# Altium schematic sheet POWER.SchDoc
size A3; SheetNumber: 8; SheetTotal: 8
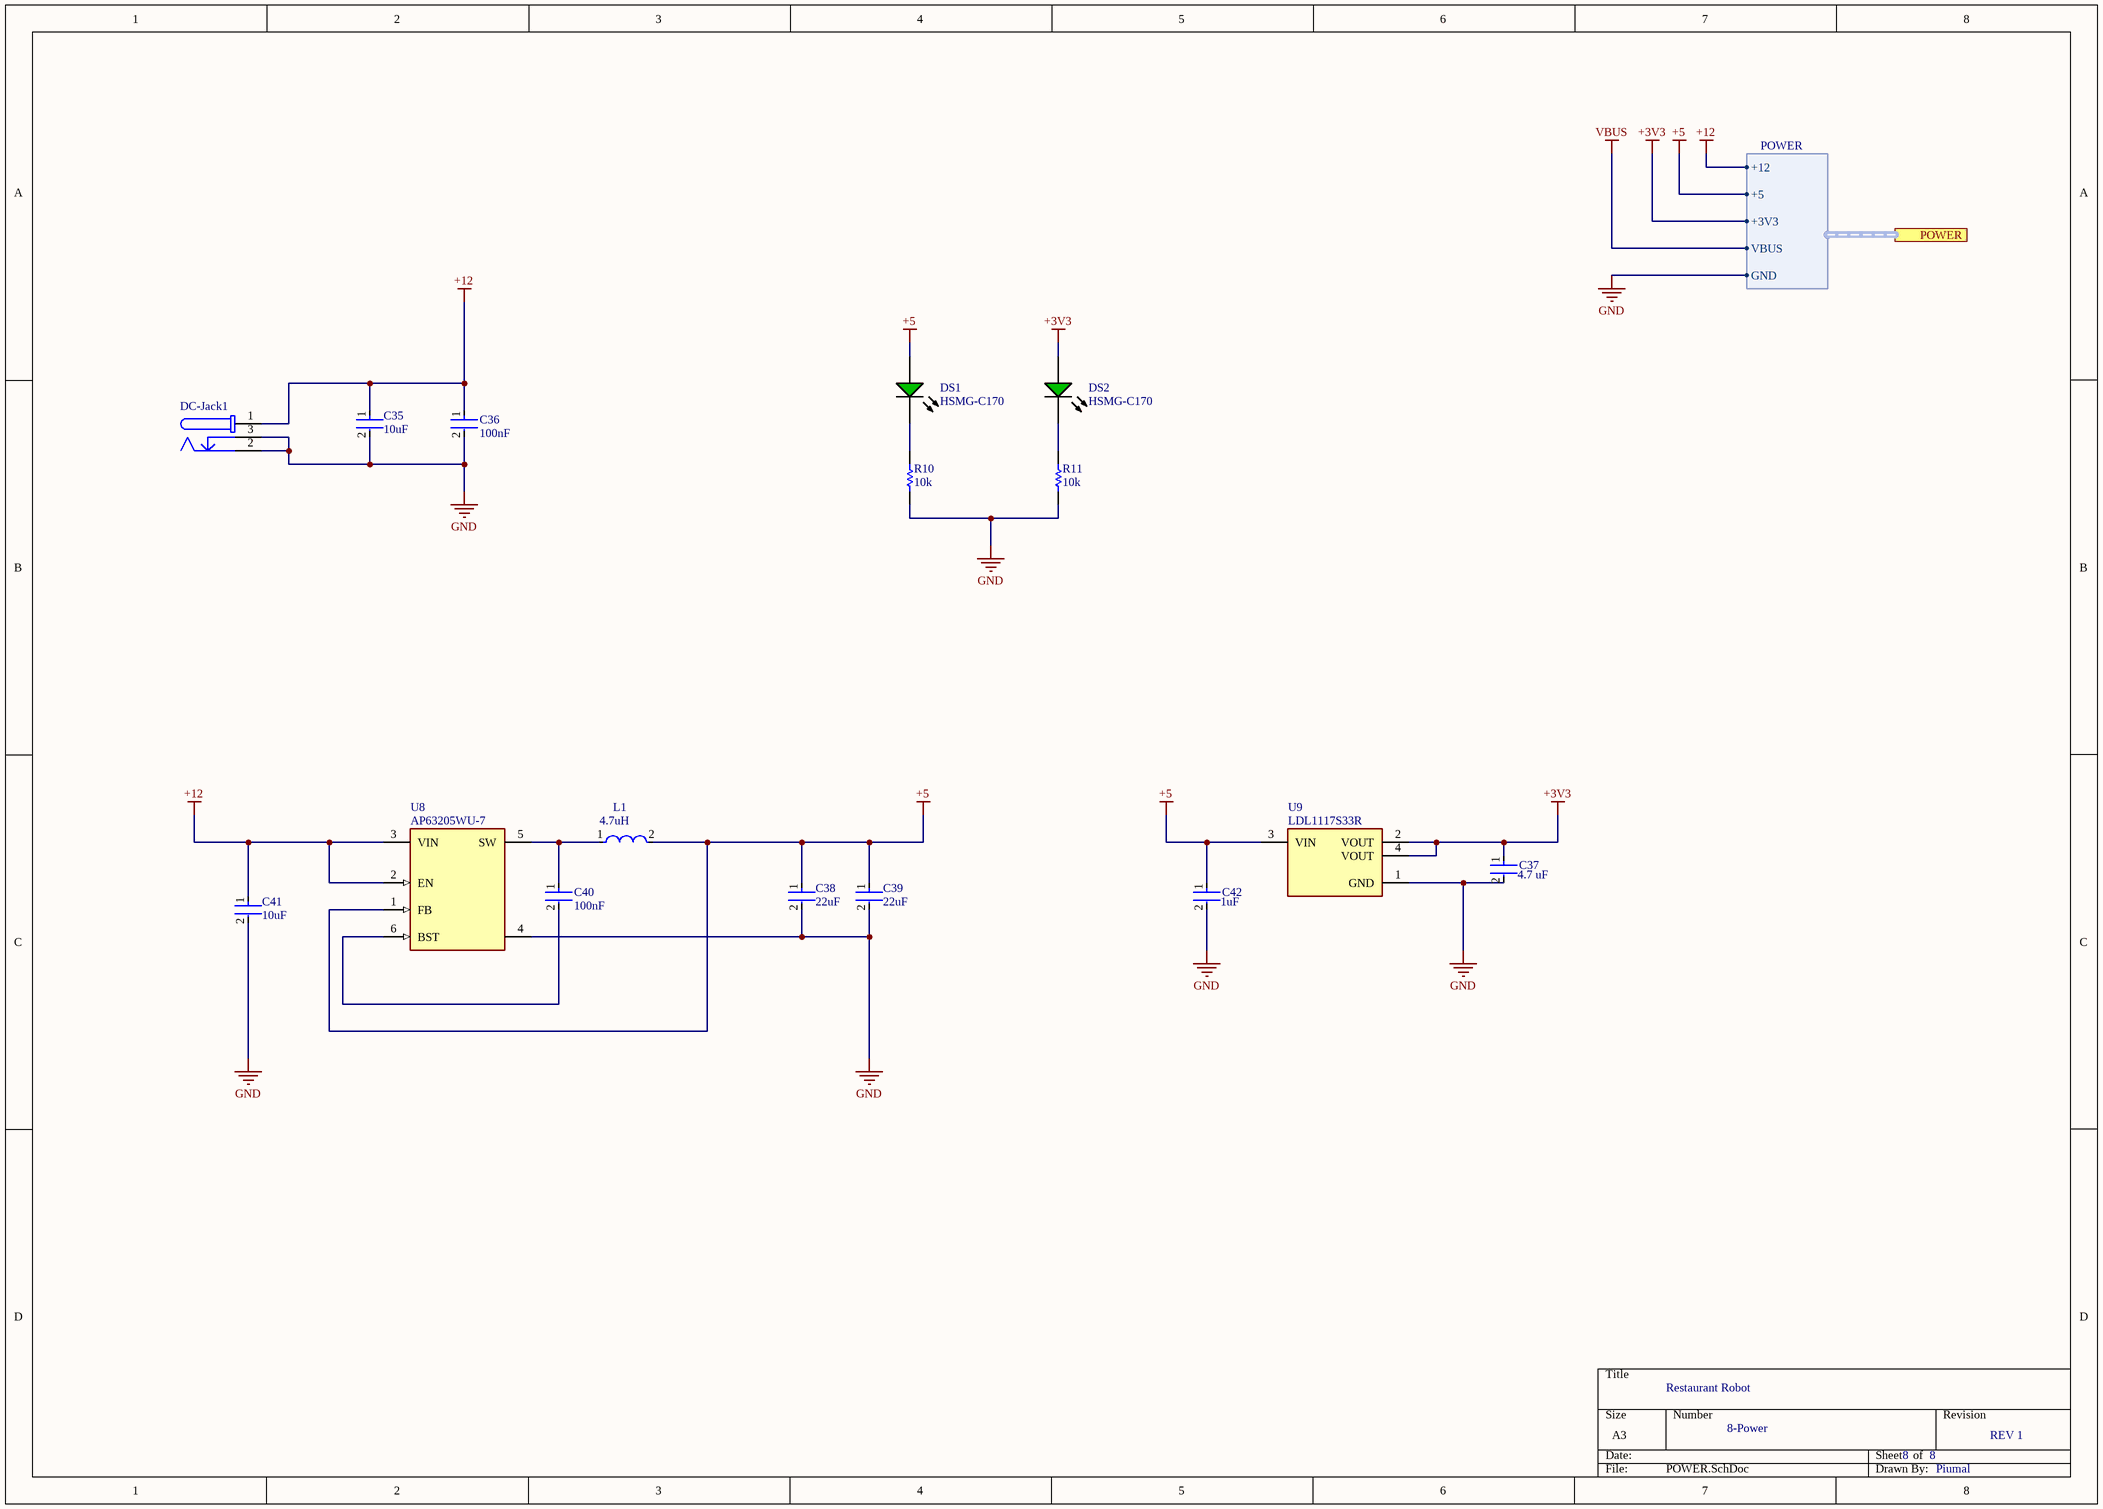
[diagram p0: POWER.SchDoc]

## Parts
C35  Capacitance: 10uF  [FP-1206-L_3_2_0_2-W_1_6_0-IPC_A]  (hidden comment: 1206ZD106KAT2A)
C36  100nF  [FP-0805-L_2_01_0_2-W_1_25-IPC_B]
C37  Capacitance: 4.7 uF  [FP-CC1206-1_25-MFG]  (hidden comment: CC1206KKX7R9BB475)
C38  Capacitance: 22uF  [FP-C3216-160-0_2-IPC_B]  (hidden comment: C3216X5R1E226M160AB)
C39  Capacitance: 22uF  [FP-C3216-160-0_2-IPC_B]  (hidden comment: C3216X5R1E226M160AB)
C40  100nF  [FP-0805-L_2_01_0_2-W_1_25-IPC_B]
C41  Capacitance: 10uF  [FP-1206-L_3_2_0_2-W_1_6_0-IPC_A]  (hidden comment: 1206ZD106KAT2A)
C42  Capacitance: 1uF  [FP-1206-L_3_2_0_2-W_1_6_0-IPC_A]  (hidden comment: 12065C105KAT2A)
DC-Jack1  694106301002  [694106301002]  (value not drawn)
DS1  HSMG-C170  [AVAG-HSMX-C170_V]
DS2  HSMG-C170  [AVAG-HSMX-C170_V]
L1  Inductance: 4.7uH  [FP-IHLP-2525BD-FP_2_413x3-MFG]  (hidden comment: IHLP2525BDER4R7M01)
R10  Resistance: 10k  [RESC2013X60X35ML10T20]  (hidden comment: RC0805JR-0710KL)
R11  Resistance: 10k  [RESC2013X60X35ML10T20]  (hidden comment: RC0805JR-0710KL)
U8  AP63205WU-7  [FP-TSOT26-MFG]
U9  LDL1117S33R  [FP-SOT223-0046067-IPC_C]

## Ports
POWER (harness POWER)

## Harnesses
POWER: +3V3, GND, +5, VBUS, +12

## Nets
+3V3: C37.1 DS2.1(A) U9.2(VOUT) U9.4(VOUT) ; port POWER.+3V3
+5: C38.1 C39.1 C42.1 DS1.1(A) L1.2 U8.1(FB) U9.3(VIN) ; port POWER.+5
+12: C35.1 C36.1 C41.1 DC-Jack1.1 U8.2(EN) U8.3(VIN) ; port POWER.+12
GND: C35.2 C36.2 C37.2 C38.2 C39.2 C41.2 C42.2 DC-Jack1.2 DC-Jack1.3 R10.2 R11.2 U8.4(GND) U9.1(GND) ; port POWER.GND
VBUS: port POWER.VBUS
NetC40_1: C40.1 L1.1 U8.5(SW)
NetC40_2: C40.2 U8.6(BST)
NetDS1_2: DS1.2(K) R10.1
NetDS2_2: DS2.2(K) R11.1

## Notes on the sheet
- Restaurant Robot
- 8-Power
- 8
- REV 1
- Piumal

## Library data of the parts
C35 C41 = CMP-04427-021870-1: General Purpose Ceramic Capacitor, 1206, 10uF, 10%, X5R, 15%, 10V; Tolerance: 10%; Thickness: 0.07inch; Voltage: 10V; Termination: SMD/SMT; REACH SVHC: No SVHC; Radiation Hardening: No; Lead Free: Lead Free; Min Operating Temperature: -55°C; Contact Plating: Tin; Length: 3.2mm; Dielectric: X5R; Packaging: Tape and Reel; Construction: Flat; RoHS Compliant: Yes; Series: -; Voltage Rating: 10V; Height: 0.07mm; Width: 0.063inch; Voltage Rating (DC): 10V; Mount: Surface Mount; Depth: 1.6mm; Number of Pins: 2; Case Code (Imperial): 1206; Size: 1.78mm; Case/Package: 1206; Max Operating Temperature: 85°C; Package Quantity: 1; Case Code (Metric): 3216
C36 C40 = CMP-2007-04172-2: Automotive Ceramic Capacitor, 0805, 100nF, 10%, X7R, 15%, 100V; Voltage Rating (DC): 100V; Case Code (Metric): 2012; Mount: Surface Mount; Length: 2.01mm; Depth: 1.25mm; Lead Free: Lead Free; Ratings: AEC-Q200; Max Operating Temperature: 125°C; Tolerance: 10%; Case/Package: 0805; Width: 0.049inch; Package Quantity: 1; Thickness: 0.055inch; Construction: Flat; Min Operating Temperature: -55°C; REACH SVHC: No SVHC; Number of Pins: 2; Radiation Hardening: No; Capacitance: 100nF; Voltage Rating: 100V; Height: 1.4mm; Series: -; Voltage: 100V; Dielectric: X7R; Termination: SMD/SMT; Case Code (Imperial): 0805; RoHS Compliant: Yes; Packaging: Tape and Reel; Dielectric Material: Ceramic
C37 = CMP-03422-000173-1: CAP CER 4.7UF 50V X7R 1206; Manufacturer: Yageo; Automotive Grade: NA; Tolerance: 0.1; Temperature Coefficient: 15%; Material: Ceramic; Device Class L1: Passive Components; Category: Cap; Height: 1.45mm; Temperature Range Low: -55°C; Temperature Range High: +125°C; Manufacturer Part Number: CC1206KKX7R9BB475; Package: CC1206-1.25; Lead Free: Yes; Temperature: -55°C to +125°C; RoHS: TRUE; Digikey Description: CAP CER 4.7UF 50V X7R 1206; Voltage Rating: 50 V; Device Class L2: Capacitors; Footprint Url: http://www.yageo.com/exep/pages/download/literatures/UPY-C_GEN_24.pdf; ComponentLink2URL: http://www.yageo.com/documents/recent/UPY-NP0X7R_HV_1KV-to-3KV_11.pdf; Temperature Characteristic: X7R; Mouser Description: CC Series 1206 4.7 uF 50 V ±10% Tolerance X7R Multilayer Ceramic Capacitor; ComponentLink2Description: Datasheet; Device Class L3: Ceramic Capacitors; Octopart: https://octopart.com/cc1206kkx7r9bb475-yageo-50417574; Value: 4.7 uF; Automotive: No
C38 C39 = CMP-08246-004697-1: Multilayer Ceramic Capacitors 22uF ±20% 25V X5R SMD 1206; RoHS Compliant: Yes; Thickness: 0.071inch; Mount: Surface Mount; Termination: SMD/SMT; Height: 1.6mm; Resistor Type: Ceramic; REACH SVHC: No SVHC; Packaging: Tape and Reel; Construction: Flat; Depth: 1.6mm; Lead Free: Lead Free; Tolerance: 20%; Width: 0.063inch; Weight: 0.000571oz; Case Code (Imperial): 1206; Case/Package: 1206; Min Operating Temperature: -55°C; Package Quantity: 1; Voltage Rating (DC): 25V; Length: 3.2mm; Voltage Rating: 25V; Case Code (Metric): 3216; Dielectric: X5R; Series: C; Dielectric Material: Ceramic; Max Operating Temperature: 85°C
C42 = CMP-2000-05866-2: General Purpose Ceramic Capacitor, 1206, 1uF, 10%, X7R, 15%, 50V; Dissipation Factor: 2.5%; Voltage: 25V; Dielectric: X7R; Radiation Hardening: No; Number of Pins: 2; Package Quantity: 1; Case Code (Metric): 3216; Thickness: 0.07inch; Voltage Rating (DC): 50V; Width: 0.063inch; Construction: Flat; Min Operating Temperature: -55°C; Length: 3.2mm; Voltage Rating: 50V; Case Code (Imperial): 1206; Height: 1.78mm; REACH SVHC: No SVHC; Mount: Surface Mount; Max Operating Temperature: 125°C; Depth: 1.6mm; Packaging: Tape and Reel; Tolerance: 10%; Lead Free: Lead Free; Termination: SMD/SMT; RoHS Compliant: Yes; Case/Package: 1206; Contact Plating: Tin; Series: -
DC-Jack1 = CMP-1502-00188-2: NexarPartId: 52676100; Voltage Rating (DC): 20V; Gender: Male; Voltage Rating: 24V; Connector Type: Power; Insulation Resistance: 100MΩ; Current Rating: 5A; Shielding: Unshielded; Number of Contacts: 3; Color: Black; Housing Material: Polyamide; Contact Gender: Female; REACH SVHC: Unknown; Termination: Through Hole; Height: 11mm; RoHS: Compliant; Mount: Through Hole; Flammability Rating: UL94 V-0; Packaging: Bulk; Min Operating Temperature: -40°C; Contact Plating: Tin; Max Operating Temperature: 85°C; Operating Supply Voltage: 24V; Contact Material: Gold, Tin
DS1 DS2 = CMP-2000-05062-1: Chip LED, Green, 2.2 V, -40 to 85 degC, 2-Pin SMD, Pb-Free, Tape and Reel; Manufacturer: Avago; No. of Pins: 2; Peak Wavelength: 570nm; SVHC: NoSVHC(16-Jun-2014); Dominant Wavelength: 572nm; Forward Current If: 20mA; Viewing Angle: 170deg; Lens Shape: Rectangular; PIV Max: 5V; External Width: 1.25mm; LED Type: Standard; External Depth: 0.8mm; Opto Mounting Orientation: Top; Luminous Intensity: 15mcd; Luminous Intensity Min: 4mcd; Forward Voltage VF Max: 2.6V; External Length / Height: 2mm; Bulb Size: 1.25mmx1.4mm; Light Area Height: 1mm; Voltage Vf Typ: 2.2V; Operating Temperature Max: 85degC; Datasheet Version: Oct-08; MSL: MSL2A-4weeks; Peak Forward Current: 20mA; Package Description: 2-Pin Surface Mount Device, Body 2 x 1.25 mm, Height 0.8 mm; Datasheet URL: https://datasheet.ciiva.com/29280/180495-da-01-en-chip-led-hsmg-c170-gelb-gruen-29280971.pdf; Storage Temperature Min: -40degC; LED Colour: Green; Wavelength Typ: 570nm; Mounting Type: SMD; Forward Current If Max: 20mA; Dominant Wavelength Typ: 572nm; LED Mounting: SMD; Operating Temperature Range: -30degCto+85degC; Operating Temperature Min: -30degC; Manufacturer URL: http://www.avagotech.com/; Packaging: CutTape; Luminous Intensity Typ: 15mcd; Package Reference: HSMX-C170; Storage Temperature Max: 85degC; Opto Case Style: SMD; Forward Voltage: 2.2V
L1 = CMP-02424-000271-1: Commercial Inductors, High Saturation Series 4.7uH 4.5A 63mΩ 20%; Self Resonant Frequency: 5MHz; DC Resistance (DCR): 63mR; Max DC Current: 10A; Core Material: Metal; Test Frequency: 100kHz; Shielding: Shielded; Radiation Hardening: No; Number of Pins: 2525; Tolerance: 20%; Termination: SMD/SMT; Depth: 6.72mm; Military Standard: Not; Max Operating Temperature: 125°C; Min Operating Temperature: -55°C; RMS Current (Irms): 4.5A; Width: 6.47mm; Saturation Current: 10A; Height: 2.4mm; Case/Package: 2525; Packaging: Tape and Reel; Current Rating: 4.5A; Length: 6.86mm; Inductance Tolerance: 20%; Package Quantity: 2000; Lead Free: Lead Free; Height - Seated (Max): 0.094inch; Mount: Surface Mount
R10 R11 = CMP-2000-05025-1: Chip Resistor, 10 KOhm, +/- 5%, 0.125 W, -55 to 155 degC, 0805 (2012 Metric), RoHS, Tape and Reel; Manufacturer: Yageo; Resistor Element Type: ThickFilm; Voltage Rating: 150V; Product Range: RCSeries; SVHC: ToBeAdvised; Resistor Case Style: 0805[2012Metric]; Temperature Coefficient: ±100ppm/degC; Power Rating: 250mW; Automotive Qualification Standard: -; Datasheet Version: REV. 2, 09/2004; Packaging: CutTape; Resistance Tolerance: ±5%; MSL: MSL1-Unlimited; Manufacturer URL: http://www.yageo.com/; Datasheet URL: http://www.yageo.ru/pdf/RC0805.pdf; Package Description: 2-Pin Surface Mounted Device, Body 2 x 1.25 mm; Package Reference: 805
U8 = CMP-12757-000001-1: IC REG BUCK 5V 2A TSOT26; Manufacturer: Diodes Inc.; Max Junction Temp: +160°C; Max Duty Cycle: 100%; Standoff Height: 0.01mm; Max Supply Voltage: 32V; Number Of Outputs: 1; Min Supply Voltage: 3.8V; Output Type: Fixed; Switching Frequency: 1100kHz; Nominal Supply Current: 22uA; Automotive: No; RoHS: TRUE; Switching Topology: Buck; Temperature: -40°C to +85°C; Footprint Url: https://www.diodes.com/assets/Package-Files/TSOT26.pdf; Lead Free: Yes; Digikey Description: IC REG BUCK 5V 2A TSOT26; Device Class L3: Voltage Regulators - Switching; Ambient Temperature Range High: +85°C; Category: IC; Package: TSOT26; Output Voltage: 5V; Output Current: 2A; ComponentLink2Description: Datasheet; Device Class L2: Power Management ICs; Ambient Temperature Range Low: -40°C; Temperature Range High: +85°C; Temperature Range Low: -40°C; Octopart: https://octopart.com/ap63205wu-7-diodes+inc.-98099551; Manufacturer Part Number: AP63205WU-7; Height: 1mm; Device Class L1: Integrated Circuits (ICs); ComponentLink2URL: https://www.diodes.com/assets/Datasheets/AP63200-AP63201-AP63203-AP63205.pdf
U9 = CMP-12153-000006-1: IC REG LINEAR 3.3V 1.2A SOT223; Manufacturer: STMicroelectronics; Output Type: Fixed; Min Supply Voltage: 2.6V; Number Of Outputs: 1; Dropout Voltage: 350mV; Output Current: 2A; Nominal Supply Current: 250uA; Standoff Height: 0.02mm; Max Supply Voltage: 18V; Max Junction Temp: +125°C; Accuracy Percentage: 2%; Automotive: No; Device Class L2: Power Management ICs; Height: 1.9mm; Octopart: https://octopart.com/ldl1117s33r-stmicroelectronics-81876163; Output Voltage: 3.3V; Package: SOT223-0046067; Lead Free: Yes; Temperature Range Low: -40°C; Category: IC; Device Class L1: Integrated Circuits (ICs); Ipc Land Pattern Name: SOT230P700X190-4; Mouser Description: LDL1117 Series 1.2 A 3.3 V High PSRR LDO Linear Voltage Regulator-SOT-223; ComponentLink2Description: Datasheet; ComponentLink2URL: https://www.st.com/resource/en/datasheet/ldl1117.pdf; Device Class L3: Voltage Regulators - Linear; Manufacturer Part Number: LDL1117S33R; Temperature Range High: +125°C; Digikey Description: IC REG LINEAR 3.3V 1.2A SOT223; Temperature: -40°C to +125°C; RoHS: TRUE